# EAGLE design AOI_Hutschiene (EAGLE 8.1.1)
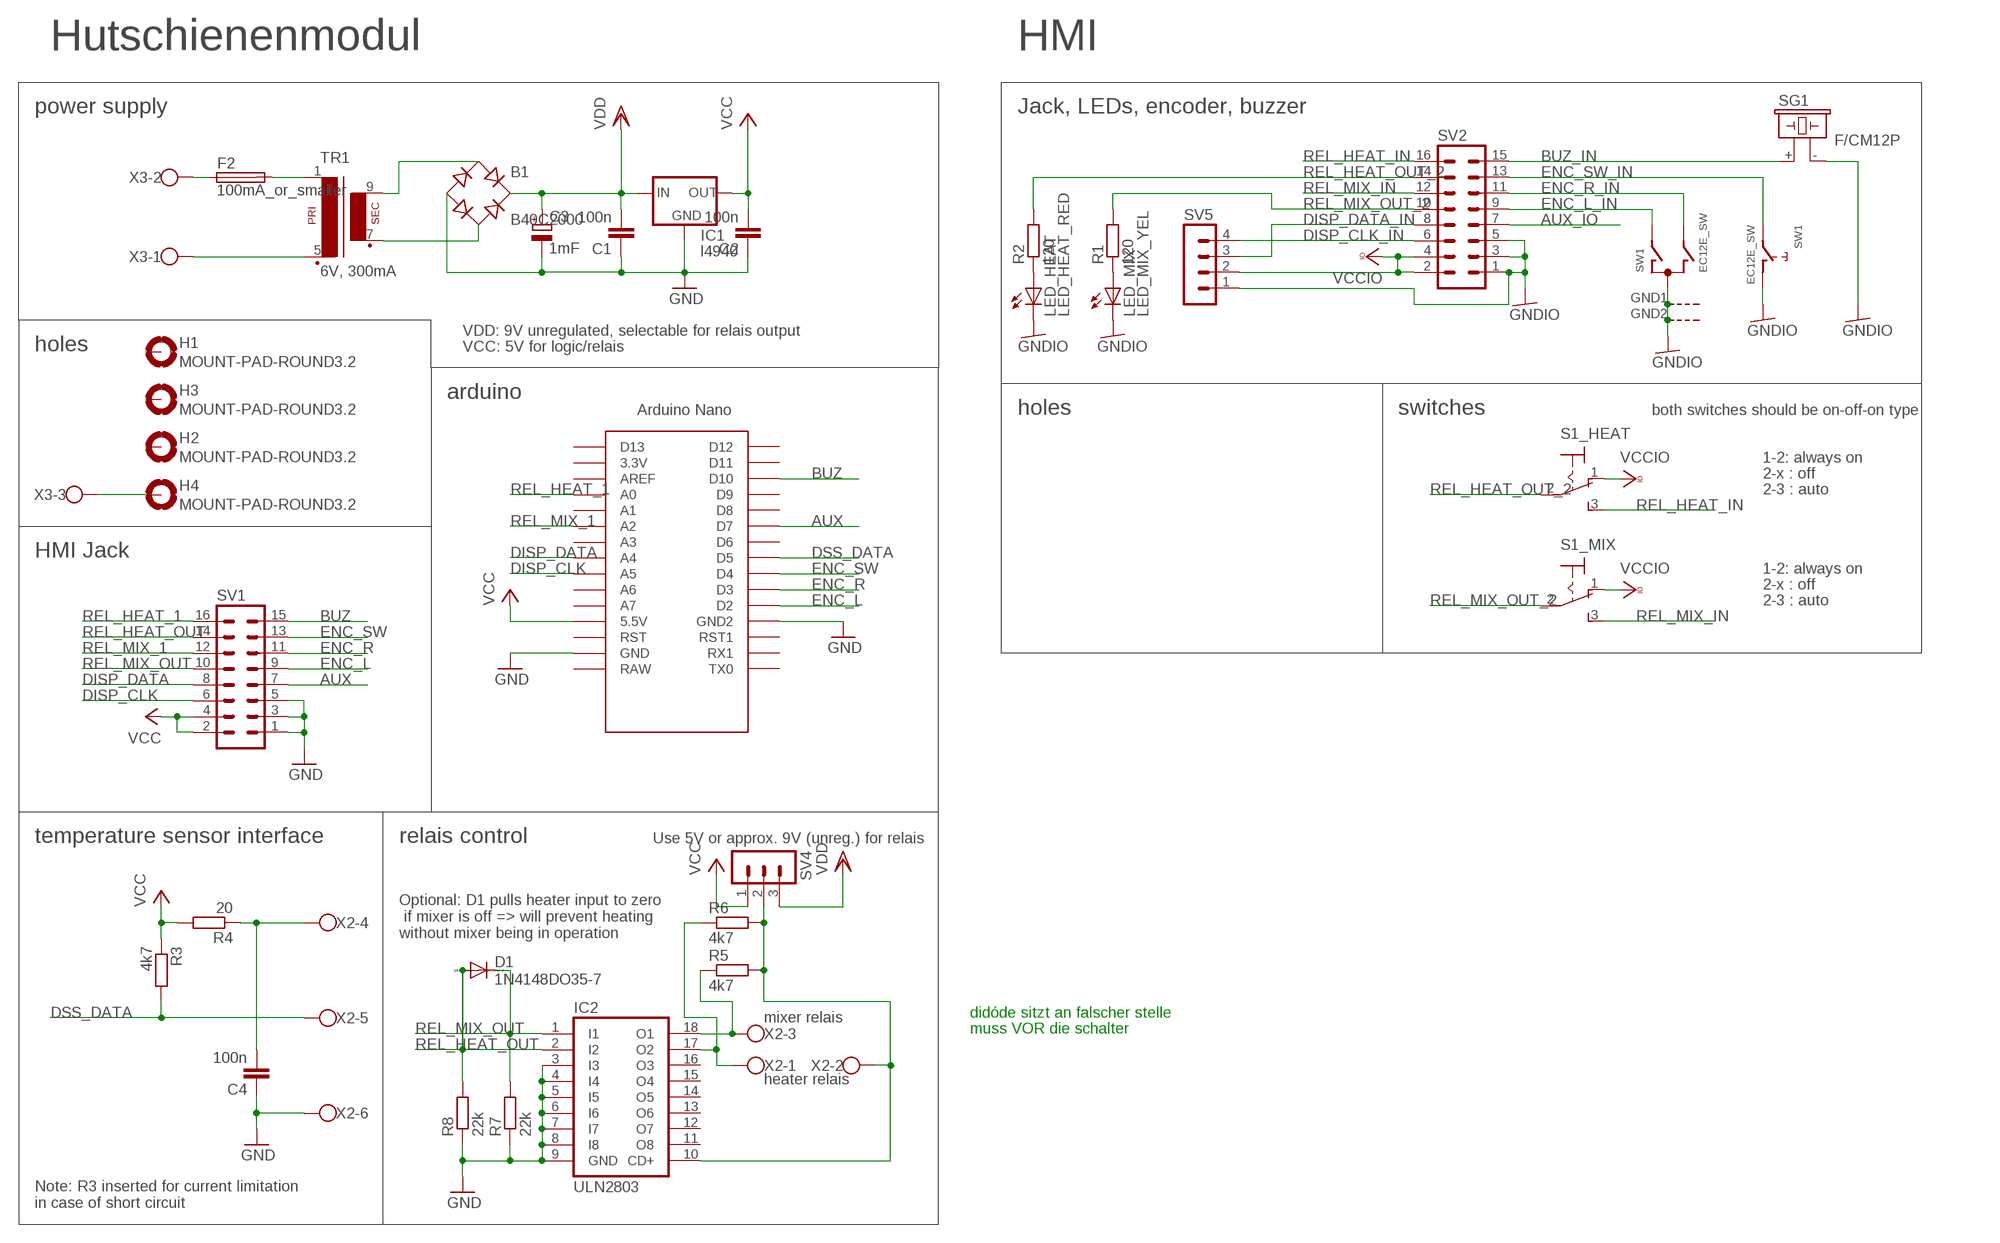
[diagram p0: schematic, sheet 1]

## Parts
B1  B40C2000  RB1A  [RB1A]
C1  100n  C-EU025_050-025X075  [C025_050-025X075]
C2  100n  C-EU025_050-025X075  [C025_050-025X075]
C3  1mF  CPOL-EUE5-13  [E5-13]
C4  100n  C-EU025_050-025X075  [C025_050-025X075]
D1  1N4148DO35-7  [DO35-7]
F2  100mA_or_smaller  FUSESH22,5  [SH22,5]
H1  MOUNT-PAD-ROUND3.2  [3,2-PAD]
H2  MOUNT-PAD-ROUND3.2  [3,2-PAD]
H3  MOUNT-PAD-ROUND3.2  [3,2-PAD]
H4  MOUNT-PAD-ROUND3.2  [3,2-PAD]
IC1  l4940  78XXS  [78XXS]
IC2  ULN2803  ULN2803A  [DIL18]
LED_HEAT  LED_HEAT_RED  LED5MM  [LED5MM]
LED_MIX  LED_MIX_YEL  LED5MM  [LED5MM]
R1  120  R-EU_0207/10  [0207/10]
R2  120  R-EU_0207/10  [0207/10]
R3  4k7  R-EU_0207/10  [0207/10]
R4  20  R-EU_0207/10  [0207/10]
R5  4k7  R-EU_0207/2V  [0207/2V]
R6  4k7  R-EU_0207/2V  [0207/2V]
R7  22k  R-EU_0207/10  [0207/10]
R8  22k  R-EU_0207/10  [0207/10]
S1_HEAT  M9040P  [M9040P]
S1_MIX  M9040P  [M9040P]
SG1  F/CM12P  [F/CM12P]
SV1  ML16  [ML16]
SV2  ML16  [ML16]
SV4  MA03-1  [MA03-1]
SV5  MA04-1  [MA04-1]
SW1  EC12E_SW  [ALPS_EC12E_SW]
TR1  6V, 300mA  EI30-1  [EI30-1]
U$1  ArdNano_with_socket  NANO  [NANO]
X2  W237-6  [W237-6]
X3  W237-103  [W237-103]

## Nets
AUX: SV1.7 U$1.D7
AUX_IO: SV2.7
BUZ: SV1.15 U$1.D10
BUZ_IN: SG1.+ SV2.15
DISP_CLK: SV1.6 U$1.A5
DISP_CLK_IN: SV2.6 SV5.4
DISP_DATA: SV1.8 U$1.A4
DISP_DATA_IN: SV2.8 SV5.3
DSS_DATA: R3.2 U$1.D5 X2.5
ENC_L: SV1.9 U$1.D2
ENC_L_IN: SV2.9 SW1.A
ENC_R: SV1.11 U$1.D3
ENC_R_IN: SV2.11 SW1.B
ENC_SW: SV1.13 U$1.D4
ENC_SW_IN: SV2.13 SW1.E
GND: B1.- C1.1 C2.1 C3.- C4.1 IC1.GND IC2.3(I3) IC2.4(I4) IC2.5(I5) IC2.6(I6) IC2.7(I7) IC2.8(I8) IC2.9(GND) R7.1 R8.1 SV1.1 SV1.3 SV1.5 U$1.GND U$1.GND1(GND2) X2.6
GNDIO: LED_HEAT.K(C) LED_MIX.K(C) SG1.- SV2.1 SV2.3 SV2.5 SV5.1 SW1.C SW1.D SW1.GND1(G) SW1.GND2(G)
N$1: IC2.10(CD+) R5.2 R6.2 SV4.2 X2.2
N$2: IC2.18(O1) R5.1 X2.3
N$3: IC2.17(O2) R6.1 X2.1
N$4: LED_HEAT.A R2.1
N$5: LED_MIX.A R1.1
N$6: F2.2 TR1.1
N$7: F2.1 X3.2
N$8: TR1.5(P2) X3.1
N$9: B1.AC1 TR1.9(S4)
N$10: B1.AC2 TR1.7(S3)
N$12: C4.2 R4.1 X2.4
N$98: H4.B3,2(MOUNT) X3.3
REL_HEAT_1: SV1.16 U$1.A0
REL_HEAT_IN: S1_HEAT.3(S) SV2.16
REL_HEAT_OUT: D1.A IC2.2(I2) R8.2 SV1.14
REL_HEAT_OUT_2: R2.2 S1_HEAT.2(P) SV2.14
REL_MIX_1: SV1.12 U$1.A2
REL_MIX_IN: S1_MIX.3(S) SV2.12
REL_MIX_OUT: D1.C IC2.1(I1) R7.2 SV1.10
REL_MIX_OUT_2: R1.2 S1_MIX.2(P) SV2.10
VCC: C2.2 IC1.OUT R3.1 R4.2 SV1.2 SV1.4 SV4.1 U$1.5V(5.5V)
VCCIO: S1_HEAT.1(O) S1_MIX.1(O) SV2.2 SV2.4 SV5.2
VDD: B1.+ C1.2 C3.+ IC1.IN SV4.3
Unconnected: H1.B3,2(MOUNT) H2.B3,2(MOUNT) H3.B3,2(MOUNT) IC2.11(O8) IC2.12(O7) IC2.13(O6) IC2.14(O5) IC2.15(O4) IC2.16(O3) U$1.3.3V U$1.A1 U$1.A3 U$1.A6 U$1.A7 U$1.AREF U$1.D6 U$1.D8 U$1.D9 U$1.D11 U$1.D12 U$1.D13 U$1.ICSP1 U$1.ICSP2 U$1.ICSP3 U$1.ICSP4 U$1.ICSP5 U$1.ICSP6 U$1.RAW U$1.RST U$1.RST1 U$1.RX1 U$1.TX0

## Notes on the sheet
- Hutschienenmodul | HMI
- power supply | Jack, LEDs, encoder, buzzer
- VDD: 9V unregulated, selectable for relais output
- holes | VCC: 5V for logic/relais
- arduino
- holes | switches | both switches should be on-off-on type
- 1-2: always on
- 2-x : off
- 2-3 : auto
- HMI Jack
- 1-2: always on
- 2-x : off
- 2-3 : auto
- temperature sensor interface | relais control | Use 5V or approx. 9V (unreg.) for relais
- Optional: D1 pulls heater input to zero
   if mixer is off => will prevent heating 
  without mixer being in operation
- didóde sitzt an falscher stelle
- mixer relais
- muss VOR die schalter
- heater relais
- Note: R3 inserted for current limitation 
  in case of short circuit

## Library data of the parts
B1 = rectifier:RB1A: RECTIFIER 1 A
C1 C2 C4 = rcl:C-EU: CAPACITOR, European symbol
C3 = rcl:CPOL-EU: POLARIZED CAPACITOR, European symbol
D1 = diode:1N4148: DIODE high speed (Philips)
F2 = fuse:FUSE: Fuse; OC_FARNELL: unknown; OC_NEWARK: unknown
H1-H4 = holes:MOUNT-PAD-ROUND: MOUNTING PAD, round
IC1 = v-reg:78XXS: VOLTAGE REGULATOR
IC2 = uln-udn:ULN2803A: DRIVER ARRAY
LED_HEAT LED_MIX = led:LED: LED OSRAM: - CHIPLED LG R971, LG N971, LY N971, LG Q971, LY Q971, LO R971, LY R971 LH N974, LH R974 LS Q976, LO Q976, LY Q976 LO Q996 - Hyper CHIPLED LW Q18S LB Q993, LB Q99A, LB R99A - SideLED LS A670, LO A670, LY A670, LG A670, LP A670 LB A673, LV A673, LT A673, LW A673 LH A674 LY A675 LS A676, LA A676, LO A676, LY A676, LW A676 LS A679, LY A679, LG A679 - Hyper Micro SIDELED® LS Y876, LA Y876, LO Y876, LY Y876 LT Y87S - SmartLED LW L88C, LW L88S LB L89C, LB L89S, LG L890 LS L89K, LO L89K, LY L89K LS L896, LA L896, LO L896, LY L896 - TOPLED LS T670, LO T670, LY T670, LG T670, LP T670 LSG T670, LSP T670, LSY T670, LOP T670, LYG T670 LG T671, LOG T671, LSG T671 LB T673, LV T673, LT T673, LW T673 LH T674 LS T676, LA T676, LO T676, LY T676, LB T676, LH T676, LSB T676, LW T676 LB T67C, LV T67C, LT T67C, LS T67K, LO T67K, LY T67K, LW E67C LS E67B, LA E67B, LO E67B, LY E67B, LB E67C, LV E67C, LT E67C LW T67C LS T679, LY T679, LG T679 LS T770, LO T770, LY T770, LG T770, LP T770 LB T773, LV T773, LT T773, LW T773 LH T774 LS E675, LA E675, LY E675, LS T675 LS T776, LA T776, LO T776, LY T776, LB T776 LHGB T686 LT T68C, LB T68C - Hyper Mini TOPLED® LB M676 - Mini TOPLED Santana® LG M470 LS M47K, LO M47K, LY M47K Source: http://www.osram.convergy.de LUXEON: - LUMILED® LXK2-PW12-R00, LXK2-PW12-S00, LXK2-PW14-U00, LXK2-PW14-V00 LXK2-PM12-R00, LXK2-PM12-S00, LXK2-PM14-U00 LXK2-PE12-Q00, LXK2-PE12-R00, LXK2-PE12-S00, LXK2-PE14-T00, LXK2-PE14-U00 LXK2-PB12-K00, LXK2-PB12-L00, LXK2-PB12-M00, LXK2-PB14-N00, LXK2-PB14-P00, LXK2-PB14-Q00 LXK2-PR12-L00, LXK2-PR12-M00, LXK2-PR14-Q00, LXK2-PR14-R00 LXK2-PD12-Q00, LXK2-PD12-R00, LXK2-PD12-S00 LXK2-PH12-R00, LXK2-PH12-S00 LXK2-PL12-P00, LXK2-PL12-Q00, LXK2-PL12-R00 Source: www.luxeon.com KINGBRIGHT: KA-3528ASYC Source: www.kingbright.com
R1-R8 = resistor:R-EU_: RESISTOR, European symbol
S1_HEAT S1_MIX = switch:M9040P: TOGGLE SWITCH Marquardt
SG1 = buzzer:F/CM12P: BUZZER Source: Buerklin; OC_FARNELL: unknown; OC_NEWARK: unknown
SV1 SV2 = con-ml:ML16: HARTING; OC_FARNELL: unknown; OC_NEWARK: unknown
SV4 = con-lstb:MA03-1: PIN HEADER; OC_FARNELL: unknown; OC_NEWARK: unknown
SV5 = con-lstb:MA04-1: PIN HEADER; OC_FARNELL: unknown; OC_NEWARK: unknown
SW1 = switch-alps:EC12E_SW: ALPS rotary Encoder EC12E series with switch; MPN: EC12E2424407; OC_FARNELL: 1520813; OC_NEWARK: 74M1068
TR1 = trafo:EI30-1: TRANSFORMER 1 primary winding, 1 secondary winding ERA
U$1 = Arduino-clone:NANO: Arduino Nano
X2 = con-wago-500:W237-6: WAGO SCREW CLAMP; OC_FARNELL: unknown; OC_NEWARK: unknown
X3 = con-wago-500:W237-103: WAGO SCREW CLAMP; MPN: 237-103; OC_FARNELL: unknown; OC_NEWARK: 18M7116

## Board
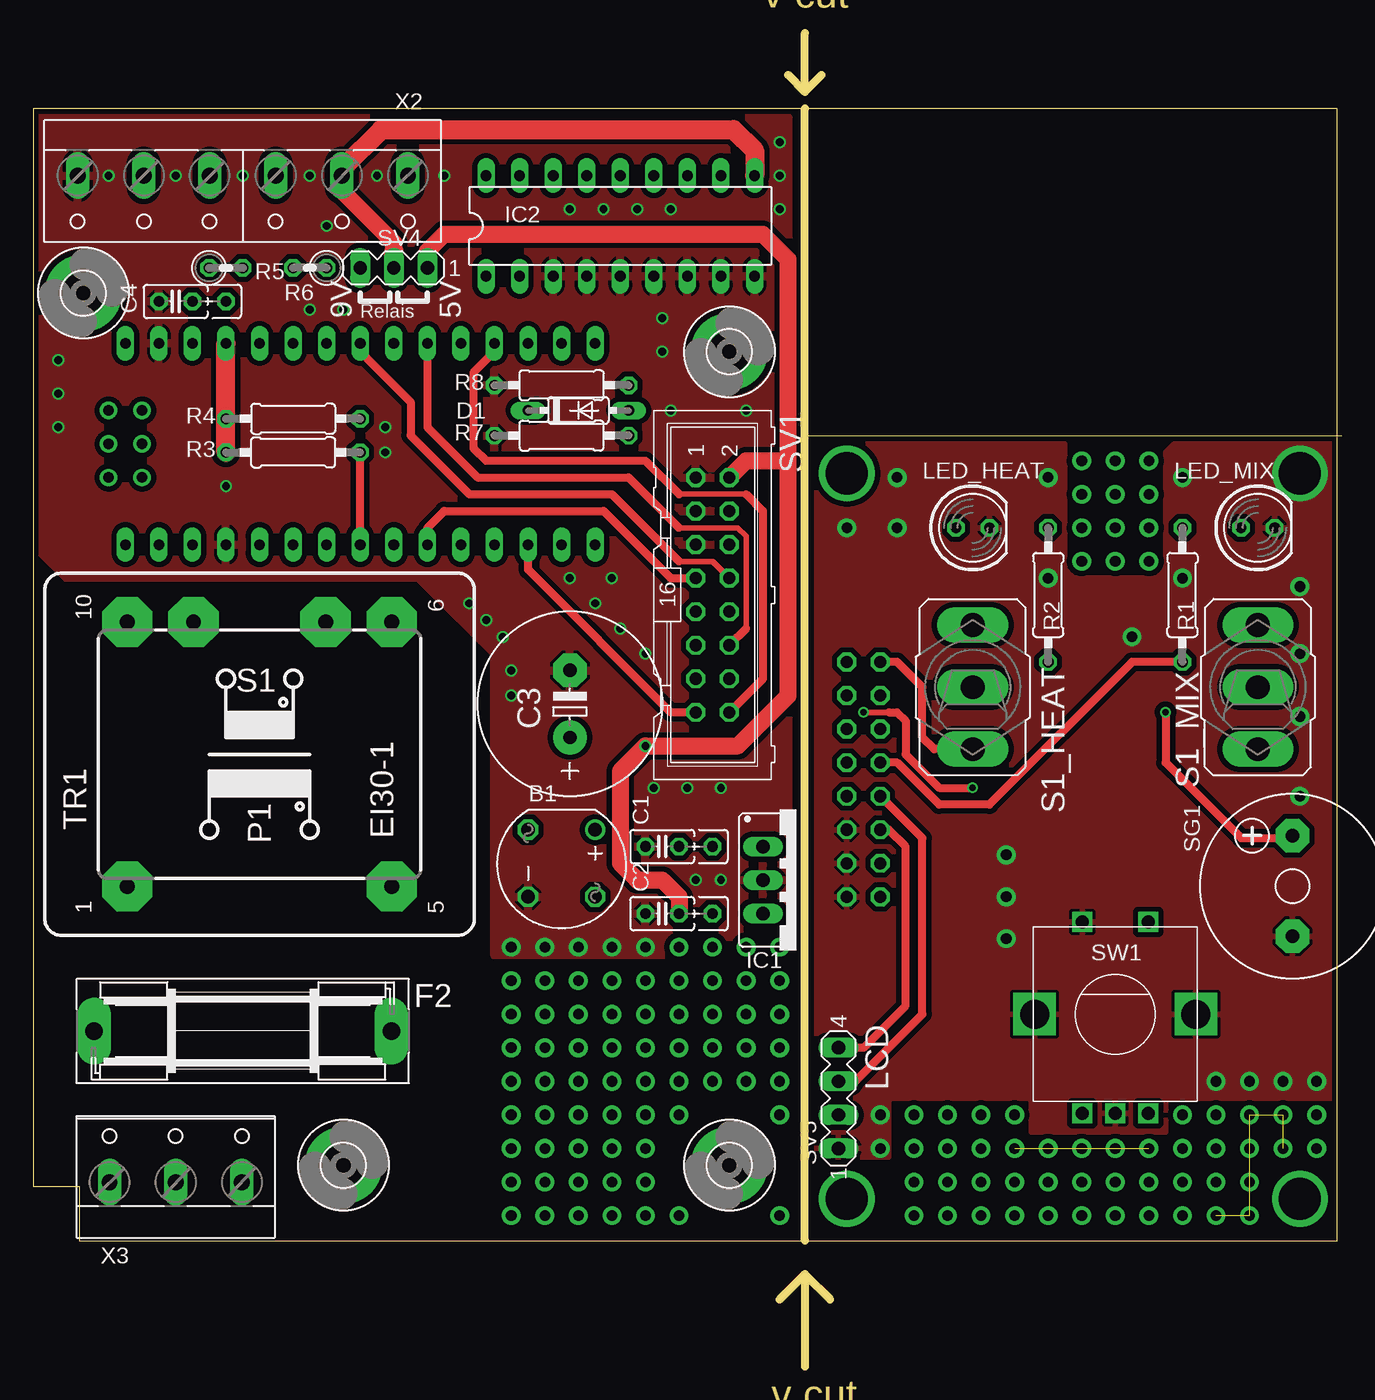
[diagram p1: board, top side]
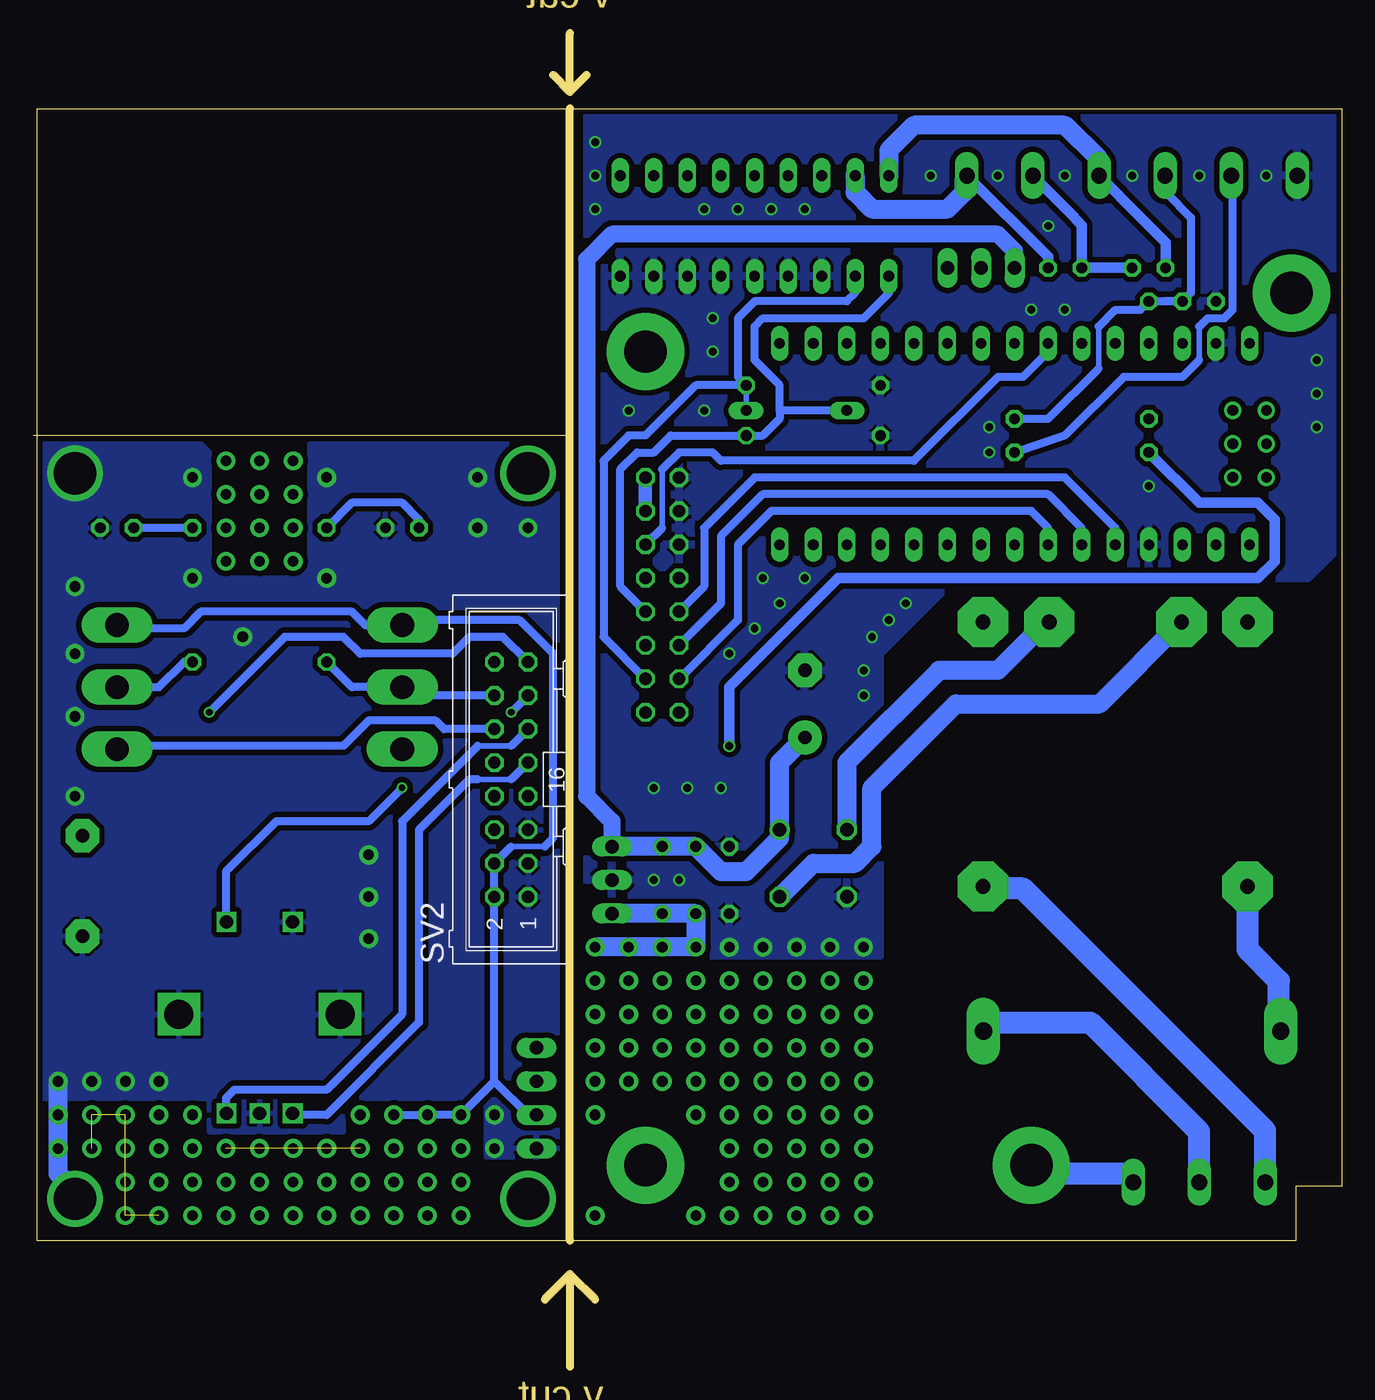
[diagram p2: board, bottom side, seen from below]

Size 99.06 x 100.97 mm. Coordinates in mm from the lower left corner, seen from the top.
Outline: 58.42,9.53 3.49,9.53 3.49,13.65 0,13.65 0,95.24 98.73,95.24 98.73,9.53 58.42,9.53
Outline: 58.42,9.53 58.42,70.48
Outline: 58.42,70.48 99.06,70.48
Outline: 58.42,70.48 58.42,94.62
Outline: 58.42,9.53 58.42,95.25
Outline: 58.42,6.99 58.42,0
Outline: 58.42,6.99 60.33,5.08
Outline: 58.42,6.99 56.52,5.08
Outline: 58.42,96.52 57.15,97.79
Outline: 58.42,96.52 59.69,97.79
Outline: 58.42,96.52 58.42,100.97
Copper layers (1*16): Top 0.035mm / dielectric 1.5mm / Bottom 0.035mm
Design rules "SeeedStudio_2layer_DRU_no_angle_20140221": minimum track width 6mil, minimum drill 12mil, track to track 6mil, track to pad 6mil, pad to pad 6mil, via to via 6mil, smd to smd 0mil, copper to edge 10mil, drill to drill 10mil, minimum pad ring 10mil, minimum via ring 6mil, stop-mask expansion 2mil, vias tented up to drill 100mil, thermal gap 10mil

### Footprints (pad centres in the part's own frame; a part is rotated, then mirrored left to right if it is on the bottom)
RB1A = drill 1.016: + -2.54,2.54 | drill 1.016 octagon: - 2.54,-2.54; AC1 2.54,2.54; AC2 -2.54,-2.54
C025_050-025X075 = drill 0.813 octagon: 1 -1.27,0; 2 1.27,0; 3 3.81,0
E5-13 = drill 1.016 pad 2.54: + -2.54,0 | drill 1.016 pad 2.54 octagon: - 2.54,0
DO35-7 = drill 0.813 long: A 3.81,0; C -3.81,0
SH22,5 = drill 1.321 pad 2.54 long: 1 -11.252,0; 2 11.252,0
3,2-PAD = drill 3.2 pad 5.842: B3,2 0,0
78XXS = drill 1.016 long: GND 0,-2.54; IN -2.54,-2.54; OUT 2.54,-2.54
DIL18 = drill 0.813 long: 1 -10.16,-3.81; 2 -7.62,-3.81; 3 -5.08,-3.81; 4 -2.54,-3.81; 5 0,-3.81; 6 2.54,-3.81; 7 5.08,-3.81; 8 7.62,-3.81; 9 10.16,-3.81; 10 10.16,3.81; 11 7.62,3.81; 12 5.08,3.81; 13 2.54,3.81; 14 0,3.81; 15 -2.54,3.81; 16 -5.08,3.81; 17 -7.62,3.81; 18 -10.16,3.81
LED5MM = drill 0.813 octagon: A -1.27,0; K 1.27,0
0207/10 = drill 0.813 octagon: 1 -5.08,0; 2 5.08,0
0207/2V = drill 0.813 octagon: 1 -1.27,0; 2 1.27,0
M9040P = drill 1.803 long: 1 0,4.699; 2 0,0; 3 0,-4.699
F/CM12P = drill 1.016 pad 2.54 octagon: + 3.81,0; - -3.81,0
ML16 = drill 0.914 octagon: 1 -8.89,-1.27; 2 -8.89,1.27; 3 -6.35,-1.27; 4 -6.35,1.27; 5 -3.81,-1.27; 6 -3.81,1.27; 7 -1.27,-1.27; 8 -1.27,1.27; 9 1.27,-1.27; 10 1.27,1.27; 11 3.81,-1.27; 12 3.81,1.27; 13 6.35,-1.27; 14 6.35,1.27; 15 8.89,-1.27; 16 8.89,1.27
MA03-1 = drill 1.016 long: 1 -2.54,0; 2 0,0; 3 2.54,0
MA04-1 = drill 1.016 long: 1 -3.81,0; 2 -1.27,0; 3 1.27,0; 4 3.81,0
ALPS_EC12E_SW = drill 1 square: A -2.5,-7.5; B 2.5,-7.5; C 0,-7.5; D -2.5,7; E 2.5,7 | drill 2.2 square: GND1 -6.1,0; GND2 6.1,0
EI30-1 = drill 1.118 pad 3.81 octagon: 1 -10.008,10.008; 5 -10.008,-10.008; 6 10.008,-10.008; 7 10.008,-5.004; 9 10.008,5.004; 10 10.008,10.008
NANO = drill 0.8 long: 3.3V -10.16,24.13; 5V -10.16,-1.27; A0 -10.16,19.05; A1 -10.16,16.51; A2 -10.16,13.97; A3 -10.16,11.43; A4 -10.16,8.89; A5 -10.16,6.35; A6 -10.16,3.81; A7 -10.16,1.27; AREF -10.16,21.59; D2 5.08,1.27; D3 5.08,3.81; D4 5.08,6.35; D5 5.08,8.89; D6 5.08,11.43; D7 5.08,13.97; D8 5.08,16.51; D9 5.08,19.05; D10 5.08,21.59; D11 5.08,24.13; D12 5.08,26.67; D13 -10.16,26.67; GND -10.16,-6.35; GND1 5.08,-1.27; RAW -10.16,-8.89; RST -10.16,-3.81; RST1 5.08,-3.81; RX1 5.08,-6.35; TX0 5.08,-8.89 | drill 0.8: ICSP1 -5.08,-10.16; ICSP2 -5.08,-7.62; ICSP3 -2.54,-10.16; ICSP4 -2.54,-7.62; ICSP5 0,-10.16; ICSP6 0,-7.62
W237-6 = drill 1.194 long: 1 -12.5,-1.27; 2 -7.5,-1.27; 3 -2.5,-1.27; 4 2.5,-1.27; 5 7.5,-1.27; 6 12.5,-1.27
W237-103 = drill 1.194 long: 1 -5,-1.29; 2 0,-1.29; 3 5,-1.29

### Placement (x,y rotation side)
B1  40.01,38.1 270 top
C1  47.62,39.37 0 top
C2  47.62,34.29 0 top
C3  40.64,50.16 90 top
C4  10.79,80.65 0 top
D1  41.27,72.39 0 top
F2  15.88,25.4 180 top
H1  52.7,76.84 0 top
H2  3.81,81.28 0 top
H3  52.7,15.24 0 top
H4  23.5,15.24 0 top
IC1  57.78,36.83 270 top
IC2  44.45,86.36 0 top
LED_HEAT  71.12,63.5 0 top
LED_MIX  92.71,63.5 0 top
R1  87,58.42 270 top
R2  76.83,58.42 270 top
R3  19.68,69.22 0 top
R4  19.68,71.75 180 top
R5  14.61,83.19 0 top
R6  20.95,83.19 180 top
R7  40.01,70.48 0 top
R8  40.01,74.3 0 top
S1_HEAT  71.12,51.43 0 top
S1_MIX  92.71,51.43 0 top
SG1  95.33,36.38 90 top
SV1  51.44,58.42 270 top
SV2  62.87,44.45 90 bottom
SV4  27.3,83.19 180 top
SV5  60.96,20.32 90 top
SW1  81.92,26.67 0 top
TR1  17.14,46.35 90 top
U$1  15.88,67.31 270 top
X2  15.88,88.9 180 top
X3  10.79,15.24 0 top

### Tracks (layer width: path | path; a pad name or v marks a point on that pad's centre or on a via)
AUX
  Top 0.61: U$1.D7 29.84,63.5 31.11,64.77 43.18,64.77 48.26,59.69 SV1.7
BUZ
  Top 0.61: SV1.15 48.26,49.53 37.47,60.32 U$1.D10
BUZ_IN  (via drill 0.5)
  Top 0.61: v85.72,49.53 85.72,45.72 91.44,40.01 95.78,40.01 SG1.+
  Bottom 0.61: SV2.15 63.5,55.24 66.04,55.24 67.31,53.98 74.3,53.98 75.56,55.24 80.01,55.24 v85.72,49.53
DISP_CLK
  Bottom 0.406: 51.44,67.95 51.44,63.5
  Bottom 0.61: U$1.A5 22.23,76.84 24.13,74.93 26.04,74.93 32.38,68.58 46.99,68.58 47.62,69.22 50.16,69.22 51.44,67.95 | 51.44,63.5 SV1.6
DISP_CLK_IN
  Top 0.61: SV2.6 64.77,40.64 66.04,39.37 66.04,27.3 62.87,24.13 SV5.4
DISP_DATA
  Top 0.406: 48.9,60.96 51.44,60.96 SV1.8
  Top 0.61: U$1.A4 24.77,76.84 28.57,73.03 28.57,70.48 33.02,66.04 43.81,66.04 48.9,60.96
DISP_DATA_IN
  Top 0.61: SV2.8 67.31,40.01 67.31,26.67 62.23,21.59 SV5.3
DSS_DATA
  Top 0.61: U$1.D5 R3.2
  Bottom 0.406: 10.79,78.74 10.79,76.2
  Bottom 0.61: 10.79,76.2 12.06,74.93 16.51,74.93 20.95,70.48 R3.2 | 10.79,78.74 10.16,79.38 8.89,79.38 8.26,80.01 8.26,90.05 X2.5
ENC_L
  Bottom 0.61: U$1.D2 17.14,63.5 20.95,67.31 44.45,67.31 48.26,63.5 48.26,59.05 SV1.9
ENC_L_IN
  Bottom 0.406: 62.87,44.45 65.41,44.45
  Bottom 0.61: SV2.9 62.87,44.45 | 65.41,44.45 66.04,44.45 69.85,40.64 69.85,26.04 76.83,19.05 79.3,19.05 SW1.A
ENC_R
  Bottom 0.61: U$1.D3 19.68,63.5 22.23,66.04 43.81,66.04 46.99,62.87 46.99,57.78 SV1.11
ENC_R_IN
  Bottom 0.406: 62.87,46.99 65.41,46.99
  Bottom 0.61: SV2.11 62.87,46.99 | 65.41,46.99 71.12,41.27 71.12,26.67 76.83,20.95 83.82,20.95 84.45,20.32 84.45,19.21 SW1.B
ENC_SW
  Bottom 0.61: U$1.D4 22.23,63.5 23.5,64.77 43.18,64.77 45.72,62.23 45.72,56.52 SV1.13
ENC_SW_IN  (via drill 0.5)
  Top 0.406: v62.87,49.53 64.77,49.53
  Top 0.61: 64.77,49.53 65.41,49.53 66.04,48.89 66.04,46.35 68.58,43.81 v71.12,43.81
  Bottom 0.61: SV2.13 v62.87,49.53 | v71.12,43.81 73.66,41.27 80.64,41.27 84.45,37.47 84.45,33.71 SW1.E
GND  (via drill 0.6, 0.8 pad 1.42)
  other vias: 46.35,53.98 44.45,55.88 42.55,57.78 40.64,59.69 43.81,59.69 52.07,36.83 50.16,36.83 46.99,43.81 49.53,43.81 52.07,43.81 26.67,69.22 26.67,71.12 22.23,86.36 15.88,90.17 20.95,90.17 20.95,80.01 23.5,80.01 1.91,73.66 1.91,76.2 1.91,71.12 33.02,57.78 34.29,56.52 35.56,55.24 40.64,87.63 43.18,87.63 45.72,87.63 48.26,87.63 31.11,90.17 26.04,90.17 10.79,90.17 5.71,90.17 36.2,31.75 38.73,31.75 41.27,31.75 43.81,31.75 46.35,31.75 47.62,79.38 47.62,76.84 48.26,72.39 14.61,66.67 36.2,52.7 36.2,50.8 56.52,92.71 56.52,90.17 56.52,87.63 53.98,72.39
  pour Bottom (isolate 0.406): 0.64,94.62 57.15,94.62 57.15,31.12 34.92,31.12 34.92,53.98 29.21,59.69 2.54,59.69 0.64,61.59
  pour Top (isolate 0.406): 0.64,94.62 57.15,94.62 57.15,31.12 34.92,31.12 34.92,53.98 29.21,59.69 2.54,59.69 0.64,61.59
GNDIO  (via drill 0.8 pad 1.42, 3.2)
  Bottom 1.422: v97.16,21.59 v97.16,19.05 v97.16,16.51 97.16,14.61 95.89,13.34 v95.89,12.7
  other vias: 95.89,67.63 89.53,21.59 94.61,21.59 92.08,21.59 64.14,19.05 64.14,16.51 95.89,43.18 95.89,49.21 95.89,53.98 95.89,59.05 73.66,38.73 73.66,35.56 73.66,32.38 61.59,63.5 65.41,63.5 65.41,67.31 76.83,67.31 76.83,59.69 87,67.31 87,59.69 83.19,55.24
  pour Top (isolate 0.406): 59.05,15.88 64.77,15.88 64.77,20.32 75.56,20.32 75.56,17.78 85.72,17.78 85.72,20.32 98.42,20.32 98.42,69.85 86.36,69.85 85.72,69.22 85.72,60.96 85.09,59.69 78.74,59.69 78.11,60.32 78.11,69.85 59.05,69.85
  pour Bottom (isolate 0.406): 59.05,69.85 58.42,15.88 64.77,15.88 64.77,20.32 75.56,20.32 75.56,17.78 85.72,17.78 85.72,20.32 98.42,20.32 98.42,69.85 86.36,69.85 85.72,69.22 85.72,60.32 85.09,59.69 78.74,59.69 78.11,60.32 78.11,69.85
N$1
  Top 1.27: 27.3,84.46 27.3,85.09 23.5,88.9 23.5,90.05 X2.2
  Top 1.422: SV4.2 27.3,84.46 | X2.2 23.5,90.29 23.5,90.81 26.35,93.66 53.02,93.66 54.61,92.08 IC2.10
  Bottom 0.813: X2.2 20.32,87.12 19.68,86.36 R6.2 R5.2
N$2
  Bottom 0.813: R5.1 13.34,85.09 14.61,86.36 15.24,87.04 X2.3
  Bottom 1.422: X2.3 18.38,91.4 20.95,93.98 32.38,93.98 34.29,92.08 IC2.18
N$3
  Bottom 0.813: R6.1 22.23,84.02 X2.1
  Bottom 1.422: IC2.17 36.83,88.9 35.56,87.63 29.84,87.63 28.57,88.9 28.57,89.97 X2.1
N$4
  Bottom 0.61: LED_HEAT.A 69.85,64.14 71.12,65.41 74.93,65.41 R2.1
N$5
  Bottom 0.61: R1.1 LED_MIX.A
N$6
  Bottom 1.676: 6.35,35.56 TR1.1 7.14,31.59 4.76,29.21 4.76,25.54 F2.2
N$7
  Bottom 1.676: X3.2 10.79,17.78 19.05,26.04 26.49,26.04 F2.1
N$8
  Bottom 1.422: 27,36.2 TR1.5
  Bottom 1.676: X3.1 5.79,17.86 24.13,36.2 27,36.2
N$9
  Bottom 1.422: B1.AC1 40.01,38.1 36.83,38.1 35.56,39.37 35.56,43.81 29.21,50.16 18.34,50.16 TR1.9
N$10
  Bottom 1.422: TR1.7 22.38,56.36 26.04,52.7 30.48,52.7 37.47,45.72 B1.AC2
N$11  (via drill 0.8 pad 1.42)
  other vias: 84.45,68.58
N$12
  Bottom 0.406: 18.41,75.57 18.41,78.74
  Bottom 0.61: R4.1 22.23,71.75 18.41,75.57 | 18.41,78.74 17.14,80.01 15.24,80.01 14.61,80.65 C4.2 | X2.4 13.34,90.17 13.34,88.9 11.43,87 11.43,81.28 C4.2 | C4.2 13.34,80.65 13.38,80.69 C4.2
N$13  (via drill 0.8 pad 1.42)
  other vias: 84.45,66.04
N$14  (via drill 0.8 pad 1.42)
  other vias: 84.45,63.5
N$15  (via drill 0.8 pad 1.42)
  other vias: 84.45,60.96
N$16  (via drill 0.8 pad 1.42)
  other vias: 81.92,60.96
N$17  (via drill 0.8 pad 1.42)
  other vias: 81.92,63.5
N$18  (via drill 0.8 pad 1.42)
  other vias: 81.92,66.04
N$19  (via drill 0.8 pad 1.42)
  other vias: 81.92,68.58
N$21  (via drill 0.8 pad 1.42)
  other vias: 79.38,66.04
N$22  (via drill 0.8 pad 1.42)
  other vias: 79.38,63.5
N$23  (via drill 0.8 pad 1.42)
  other vias: 79.38,60.96
N$25  (via drill 0.8 pad 1.42)
  other vias: 79.38,68.58
N$26  (via drill 0.8 pad 1.42)
  other vias: 66.67,13.97
N$27  (via drill 0.8 pad 1.42)
  other vias: 69.22,13.97
N$28  (via drill 0.8 pad 1.42)
  other vias: 71.75,13.97
N$29  (via drill 0.8 pad 1.42)
  other vias: 74.3,13.97
N$30  (via drill 0.8 pad 1.42)
  other vias: 74.3,11.43
N$31  (via drill 0.8 pad 1.42)
  other vias: 71.75,11.43
N$32  (via drill 0.8 pad 1.42)
  other vias: 69.22,11.43
N$33  (via drill 0.8 pad 1.42)
  other vias: 66.67,11.43
N$36  (via drill 0.8 pad 1.42)
  other vias: 36.2,21.59
N$37  (via drill 0.8 pad 1.42)
  other vias: 36.2,24.13
N$38  (via drill 0.8 pad 1.42)
  other vias: 36.2,26.67
N$39  (via drill 0.8 pad 1.42)
  other vias: 36.2,29.21
N$40  (via drill 0.8 pad 1.42)
  other vias: 38.73,29.21
N$41  (via drill 0.8 pad 1.42)
  other vias: 38.73,26.67
N$42  (via drill 0.8 pad 1.42)
  other vias: 38.73,24.13
N$43  (via drill 0.8 pad 1.42)
  other vias: 38.73,21.59
N$44  (via drill 0.8 pad 1.42)
  other vias: 41.27,24.13
N$45  (via drill 0.8 pad 1.42)
  other vias: 41.27,26.67
N$46  (via drill 0.8 pad 1.42)
  other vias: 41.27,29.21
N$47  (via drill 0.8 pad 1.42)
  other vias: 41.27,21.59
N$48  (via drill 0.8 pad 1.42)
  other vias: 43.81,21.59
N$49  (via drill 0.8 pad 1.42)
  other vias: 43.81,24.13
N$50  (via drill 0.8 pad 1.42)
  other vias: 43.81,26.67
N$51  (via drill 0.8 pad 1.42)
  other vias: 43.81,29.21
N$52  (via drill 0.8 pad 1.42)
  other vias: 46.35,29.21
N$53  (via drill 0.8 pad 1.42)
  other vias: 46.35,26.67
N$54  (via drill 0.8 pad 1.42)
  other vias: 46.35,24.13
N$55  (via drill 0.8 pad 1.42)
  other vias: 46.35,21.59
N$56  (via drill 0.8 pad 1.42)
  other vias: 36.2,11.43
N$57  (via drill 0.8 pad 1.42)
  other vias: 36.2,13.97
N$58  (via drill 0.8 pad 1.42)
  other vias: 36.2,16.51
N$59  (via drill 0.8 pad 1.42)
  other vias: 36.2,19.05
N$60  (via drill 0.8 pad 1.42)
  other vias: 38.73,19.05
N$61  (via drill 0.8 pad 1.42)
  other vias: 38.73,16.51
N$62  (via drill 0.8 pad 1.42)
  other vias: 38.73,13.97
N$63  (via drill 0.8 pad 1.42)
  other vias: 38.73,11.43
N$64  (via drill 0.8 pad 1.42)
  other vias: 41.27,13.97
N$65  (via drill 0.8 pad 1.42)
  other vias: 41.27,16.51
N$66  (via drill 0.8 pad 1.42)
  other vias: 41.27,19.05
N$67  (via drill 0.8 pad 1.42)
  other vias: 41.27,11.43
N$68  (via drill 0.8 pad 1.42)
  other vias: 43.81,11.43
N$69  (via drill 0.8 pad 1.42)
  other vias: 43.81,13.97
N$70  (via drill 0.8 pad 1.42)
  other vias: 43.81,16.51
N$71  (via drill 0.8 pad 1.42)
  other vias: 43.81,19.05
N$72  (via drill 0.8 pad 1.42)
  other vias: 46.35,19.05
N$73  (via drill 0.8 pad 1.42)
  other vias: 46.35,16.51
N$74  (via drill 0.8 pad 1.42)
  other vias: 46.35,13.97
N$75  (via drill 0.8 pad 1.42)
  other vias: 46.35,11.43
N$76  (via drill 0.8 pad 1.42)
  other vias: 48.9,29.21
N$77  (via drill 0.8 pad 1.42)
  other vias: 48.9,26.67
N$78  (via drill 0.8 pad 1.42)
  other vias: 48.9,24.13
N$80  (via drill 0.8 pad 1.42)
  other vias: 51.44,24.13
N$81  (via drill 0.8 pad 1.42)
  other vias: 51.44,26.67
N$82  (via drill 0.8 pad 1.42)
  other vias: 51.44,29.21
N$83  (via drill 0.8 pad 1.42)
  other vias: 51.44,21.59
N$84  (via drill 0.8 pad 1.42)
  other vias: 53.98,21.59
N$85  (via drill 0.8 pad 1.42)
  other vias: 53.98,24.13
N$86  (via drill 0.8 pad 1.42)
  other vias: 53.98,26.67
N$87  (via drill 0.8 pad 1.42)
  other vias: 53.98,29.21
N$88  (via drill 0.8 pad 1.42)
  other vias: 56.52,29.21
N$89  (via drill 0.8 pad 1.42)
  other vias: 56.52,26.67
N$90  (via drill 0.8 pad 1.42)
  other vias: 56.52,24.13
N$92  (via drill 0.8 pad 1.42)
  other vias: 48.9,21.59
N$93  (via drill 0.8 pad 1.42)
  other vias: 48.9,19.05
N$94  (via drill 0.8 pad 1.42)
  other vias: 48.9,11.43
N$95  (via drill 0.8 pad 1.42)
  other vias: 56.52,21.59
N$96  (via drill 0.8 pad 1.42)
  other vias: 56.52,19.05
N$97  (via drill 0.8 pad 1.42)
  other vias: 56.52,11.43
N$98
  Bottom 1.27: X3.3 15.79,14.53 15.88,14.61
  Bottom 1.676: 15.88,14.61 22.86,14.61 H4.B3,2
N$99  (via drill 3.2)
  other vias: 61.59,67.63
N$100  (via drill 3.2)
  other vias: 61.59,12.7
N$104  (via drill 0.8 pad 1.42)
  other vias: 74.3,19.05
N$105  (via drill 0.8 pad 1.42)  (4 unrouted)
  other vias: 74.3,16.51 76.83,16.51 79.38,16.51 81.92,16.51 84.45,16.51
N$106  (via drill 0.8 pad 1.42)
  other vias: 71.75,16.51
N$107  (via drill 0.8 pad 1.42)
  other vias: 69.22,16.51
N$108  (via drill 0.8 pad 1.42)
  other vias: 66.67,16.51
N$109  (via drill 0.8 pad 1.42)
  other vias: 76.83,13.97
N$110  (via drill 0.8 pad 1.42)
  other vias: 79.38,13.97
N$111  (via drill 0.8 pad 1.42)
  other vias: 81.92,13.97
N$112  (via drill 0.8 pad 1.42)
  other vias: 84.45,13.97
N$113  (via drill 0.8 pad 1.42)
  other vias: 84.45,11.43
N$114  (via drill 0.8 pad 1.42)
  other vias: 81.92,11.43
N$115  (via drill 0.8 pad 1.42)
  other vias: 79.38,11.43
N$116  (via drill 0.8 pad 1.42)
  other vias: 76.83,11.43
N$117  (via drill 0.8 pad 1.42)
  other vias: 87,11.43
N$118  (via drill 0.8 pad 1.42)
  other vias: 87,13.97
N$119  (via drill 0.8 pad 1.42)
  other vias: 87,16.51
N$120  (via drill 0.8 pad 1.42)
  other vias: 87,19.05
N$121  (via drill 0.8 pad 1.42)
  other vias: 89.53,19.05
N$122  (via drill 0.8 pad 1.42)
  other vias: 89.53,16.51
N$123  (via drill 0.8 pad 1.42)
  other vias: 89.53,13.97
N$124  (via drill 0.8 pad 1.42)  (6 unrouted)
  other vias: 89.53,11.43 92.08,11.43 92.08,13.97 92.08,16.51 92.08,19.05 94.61,19.05 94.61,16.51
REL_HEAT_1
  Top 0.406: 48.9,66.04 53.98,66.04
  Top 0.61: U$1.A0 34.92,76.84 33.34,75.25 33.34,69.53 34.29,68.58 46.35,68.58 48.9,66.04 | 53.98,66.04 55.24,64.77 55.24,52.07 SV1.16
REL_HEAT_IN
  Top 0.61: S1_HEAT.3 68.2,46.74 67.31,47.62 67.31,51.43 65.41,53.34 SV2.16
REL_HEAT_OUT
  Bottom 0.406: D1.A R8.2
  Bottom 0.61: IC2.2 36.83,81.28 37.47,80.65 44.45,80.65 45.72,79.38 45.72,74.93 R8.2 48.9,74.3 52.7,70.48 53.98,70.48 55.88,68.58 55.88,55.24 SV1.14
REL_HEAT_OUT_2
  Bottom 0.61: SV2.14 70.48,50.8 S1_HEAT.2 74.93,51.43 R2.2
REL_MIX_1
  Top 0.406: 48.9,63.5 53.34,63.5 53.98,62.87 53.98,55.88
  Top 0.61: U$1.A2 29.84,71.12 33.66,67.31 45.09,67.31 48.9,63.5 | 53.98,55.88 SV1.12
REL_MIX_IN
  Bottom 0.61: SV2.12 67.94,48.26 68.58,48.89 73.66,48.89 75.56,46.99 92.71,46.99 S1_MIX.3
REL_MIX_OUT
  Bottom 0.61: SV1.10 54.61,59.05 54.61,67.95 53.34,69.22 52.07,69.22 50.8,70.48 R7.2 43.81,70.48 42.55,71.75 42.55,72.39 | 42.55,72.39 42.55,74.3 44.45,76.2 44.45,78.74 43.81,79.38 36.2,79.38 34.29,81.28 IC2.1 | D1.C 42.55,72.39
REL_MIX_OUT_2
  Top 0.61: R1.2 83.19,53.34 72.39,42.55 68.58,42.55 65.41,45.72 SV2.10
  Bottom 0.61: S1_MIX.2 89.53,51.43 87.63,53.34 R1.2
VCC  (via drill 0.6, 0.8 pad 1.42)
  Top 0.813: U$1.5V R3.1
  Top 1.27: C2.2 48.9,35.56 47.62,36.83 45.72,36.83 44.45,38.1 44.45,45.09 v46.35,46.99 53.34,46.99 57.15,50.8 57.15,68.58 | SV1.2 53.98,68.58 57.15,68.58 | 57.15,68.58 57.15,83.82 55.24,85.73 31.11,85.73 29.84,84.46 SV4.1
  Top 1.422: R3.1 R4.2 U$1.5V
  Bottom 0.813: R3.1 10.79,65.41 6.35,65.41 5.08,64.14 5.08,60.96 6.35,59.69 38.1,59.69 46.35,51.43 v46.35,46.99
  Bottom 1.016: SV1.4 SV1.2
  Bottom 1.422: IC1.OUT C2.2 v48.9,31.75 v51.44,31.75 v53.98,31.75 v56.52,31.75
VCCIO  (via drill 0.8 pad 1.42)
  Bottom 0.406: 62.87,39.37 60.33,39.37
  Bottom 0.61: 64.14,21.59 SV2.2 SV2.4 62.87,39.37 | S1_MIX.1 92.46,55.88 87.63,55.88 86.36,57.15 74.93,57.15 73.91,56.13 S1_HEAT.1 70.74,56.52 62.23,56.52 59.69,53.98 59.69,40.01 60.33,39.37 | v71.75,19.05 v69.22,19.05 v66.67,19.05 64.14,21.59 | 64.14,21.59 61.59,19.05 SV5.2
VDD
  Bottom 1.27: SV4.3 24.77,84.46 26.04,85.73 55.24,85.73 57.15,83.82 57.15,43.18 55.24,41.27 IC1.IN
  Bottom 1.422: IC1.IN C1.2 46.99,37.47 45.09,37.47 42.55,40.01 B1.+ 42.55,45.72 C3.+

### Text on the board
Dimension: v cut | v cut
tPlace: 9V | 5V
tNames: Relais | LCD
Document: SENS_GND | SENS_DATA | SENS_VCC | MIX | REL_+ | HEAT | arduino: with socket, top side